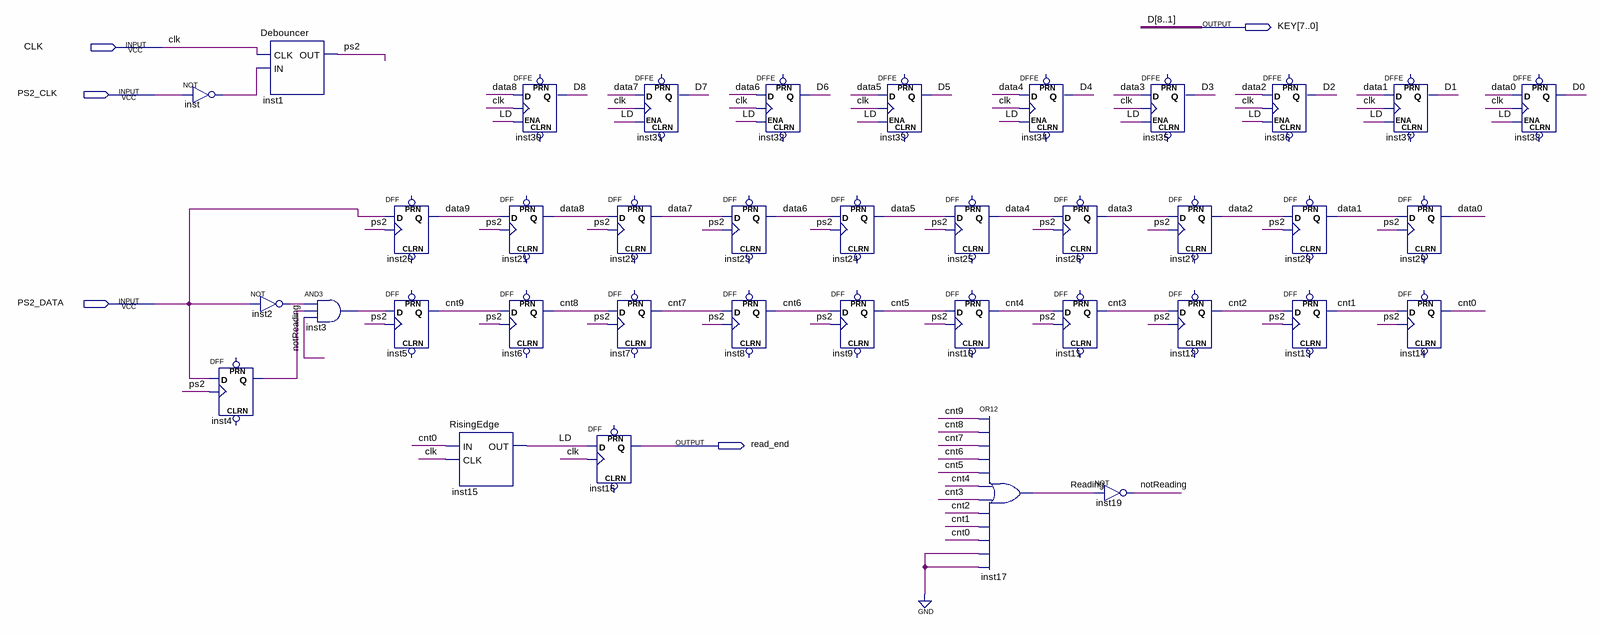
[diagram p0: schematic sheet]
// Quartus schematic PS2.bdf as structural Verilog: 38 symbols, 5 pins
module PS2 (
  input  CLK,
  input  PS2_CLK,
  input  PS2_DATA,
  output [7:0] KEY,
  output read_end
);

  wire cnt0, cnt1, cnt2, cnt3, cnt4, cnt5, cnt6, cnt7, cnt8, cnt9, D0, data0, data1, data2, data3, data4,
       data5, data6, data7, data8, data9, inst2_out, inst3_out, inst4_q, inst_out, LD, notReading, ps2,
       Reading;

  not inst (inst_out, PS2_CLK);
  Debouncer inst1 (.CLK(CLK), .IN(inst_out), .OUT(ps2));
  not inst2 (inst2_out, PS2_DATA);
  DFF inst4 (.CLK(ps2), .D(PS2_DATA), .Q(inst4_q));  // open: CLRN, PRN
  and inst3 (inst3_out, inst2_out, inst4_q, notReading);
  DFF inst20 (.CLK(ps2), .D(PS2_DATA), .Q(data9));  // open: CLRN, PRN
  DFF inst5 (.CLK(ps2), .D(inst3_out), .Q(cnt9));  // open: CLRN, PRN
  RisingEdge inst15 (.IN(cnt0), .CLK(CLK), .OUT(LD));
  DFFE inst30 (.D(data8), .CLK(CLK), .ENA(LD), .Q(KEY[7]));  // open: PRN, CLRN
  DFF inst21 (.CLK(ps2), .D(data9), .Q(data8));  // open: CLRN, PRN
  DFF inst6 (.CLK(ps2), .D(cnt9), .Q(cnt8));  // open: CLRN, PRN
  DFFE inst31 (.D(data7), .CLK(CLK), .ENA(LD), .Q(KEY[6]));  // open: PRN, CLRN
  DFF inst22 (.CLK(ps2), .D(data8), .Q(data7));  // open: CLRN, PRN
  DFF inst7 (.CLK(ps2), .D(cnt8), .Q(cnt7));  // open: CLRN, PRN
  DFF inst16 (.CLK(CLK), .D(LD), .Q(read_end));  // open: CLRN, PRN
  DFF inst23 (.CLK(ps2), .D(data7), .Q(data6));  // open: CLRN, PRN
  DFF inst8 (.CLK(ps2), .D(cnt7), .Q(cnt6));  // open: CLRN, PRN
  DFFE inst32 (.D(data6), .CLK(CLK), .ENA(LD), .Q(KEY[5]));  // open: PRN, CLRN
  DFF inst24 (.CLK(ps2), .D(data6), .Q(data5));  // open: CLRN, PRN
  DFF inst9 (.CLK(ps2), .D(cnt6), .Q(cnt5));  // open: CLRN, PRN
  DFFE inst33 (.D(data5), .CLK(CLK), .ENA(LD), .Q(KEY[4]));  // open: PRN, CLRN
  DFF inst25 (.CLK(ps2), .D(data5), .Q(data4));  // open: CLRN, PRN
  DFF inst10 (.CLK(ps2), .D(cnt5), .Q(cnt4));  // open: CLRN, PRN
  or inst17 (Reading, cnt9, cnt8, cnt7, cnt6, cnt5, cnt4, cnt3, cnt2, cnt1, cnt0, 1'b0, 1'b0);
  DFFE inst34 (.D(data4), .CLK(CLK), .ENA(LD), .Q(KEY[3]));  // open: PRN, CLRN
  DFF inst26 (.CLK(ps2), .D(data4), .Q(data3));  // open: CLRN, PRN
  DFF inst11 (.CLK(ps2), .D(cnt4), .Q(cnt3));  // open: CLRN, PRN
  not inst19 (notReading, Reading);
  DFFE inst35 (.D(data3), .CLK(CLK), .ENA(LD), .Q(KEY[2]));  // open: PRN, CLRN
  DFF inst27 (.CLK(ps2), .D(data3), .Q(data2));  // open: CLRN, PRN
  DFF inst12 (.CLK(ps2), .D(cnt3), .Q(cnt2));  // open: CLRN, PRN
  DFFE inst36 (.D(data2), .CLK(CLK), .ENA(LD), .Q(KEY[1]));  // open: PRN, CLRN
  DFF inst28 (.CLK(ps2), .D(data2), .Q(data1));  // open: CLRN, PRN
  DFF inst13 (.CLK(ps2), .D(cnt2), .Q(cnt1));  // open: CLRN, PRN
  DFFE inst37 (.D(data1), .CLK(CLK), .ENA(LD), .Q(KEY[0]));  // open: PRN, CLRN
  DFF inst29 (.CLK(ps2), .D(data1), .Q(data0));  // open: CLRN, PRN
  DFF inst14 (.CLK(ps2), .D(cnt1), .Q(cnt0));  // open: CLRN, PRN
  DFFE inst38 (.D(data0), .CLK(CLK), .ENA(LD), .Q(D0));  // open: PRN, CLRN

  // Other names for the same wires on the sheet: D[8:1] = KEY; D1 = KEY[0]; D2 = KEY[1]; D3 = KEY[2]; D4 = KEY[3];
  //   D5 = KEY[4]; D6 = KEY[5]; D7 = KEY[6]; D8 = KEY[7]
endmodule
